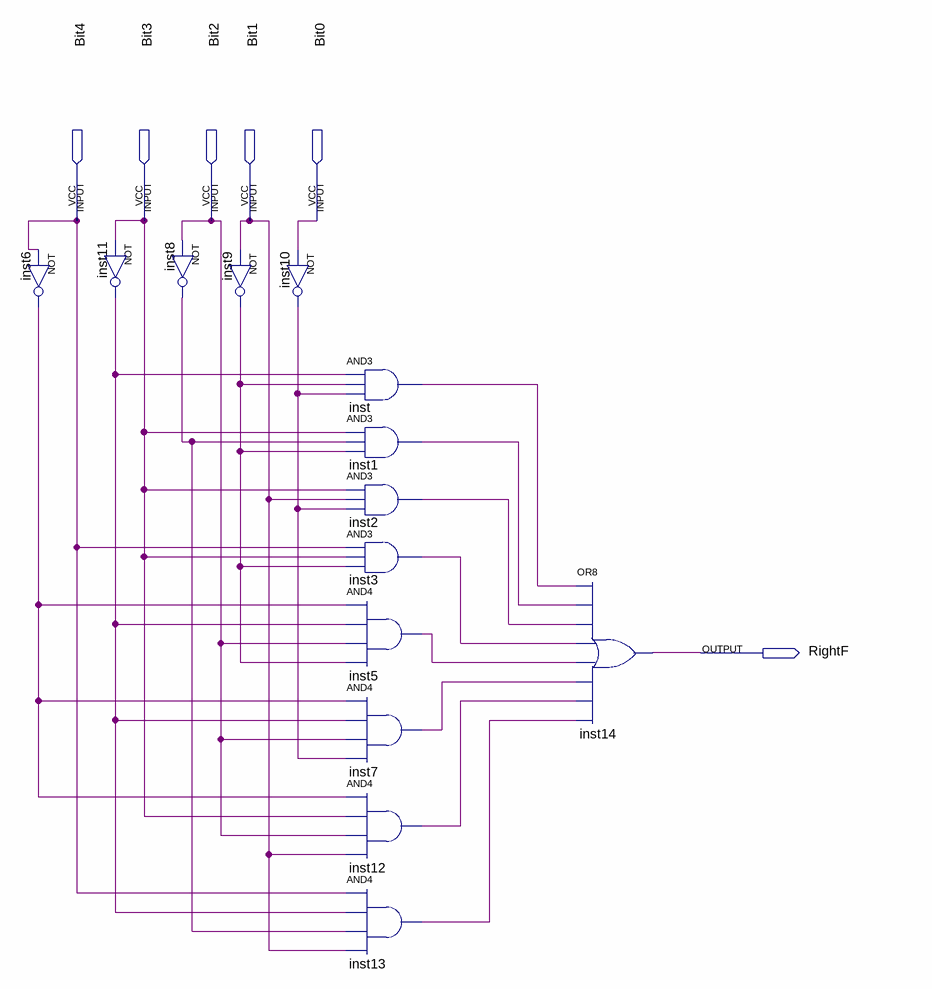
[diagram p0: schematic sheet]
// Quartus schematic RightF.bdf as structural Verilog: 14 symbols, 6 pins
module RightF (
  input  Bit4,
  input  Bit3,
  input  Bit2,
  input  Bit1,
  input  Bit0,
  output RightF
);

  wire inst1_out, inst2_out, inst3_out, inst5_out, inst6_out, inst7_out, inst8_out, inst9_out, inst10_out,
       inst11_out, inst12_out, inst13_out, inst_out;

  not inst6 (inst6_out, Bit4);
  not inst11 (inst11_out, Bit3);
  not inst8 (inst8_out, Bit2);
  not inst9 (inst9_out, Bit1);
  not inst10 (inst10_out, Bit0);
  and inst (inst_out, inst11_out, inst9_out, inst10_out);
  and inst1 (inst1_out, Bit3, inst8_out, inst9_out);
  and inst2 (inst2_out, Bit3, Bit1, inst10_out);
  and inst3 (inst3_out, Bit4, Bit3, inst9_out);
  and inst5 (inst5_out, inst6_out, inst11_out, Bit2, inst9_out);
  and inst7 (inst7_out, inst6_out, inst11_out, Bit2, inst10_out);
  and inst12 (inst12_out, inst6_out, Bit3, Bit2, Bit1);
  and inst13 (inst13_out, Bit4, inst11_out, inst8_out, Bit1);
  or inst14 (RightF, inst_out, inst1_out, inst2_out, inst3_out, inst5_out, inst7_out, inst12_out, inst13_out);
endmodule
